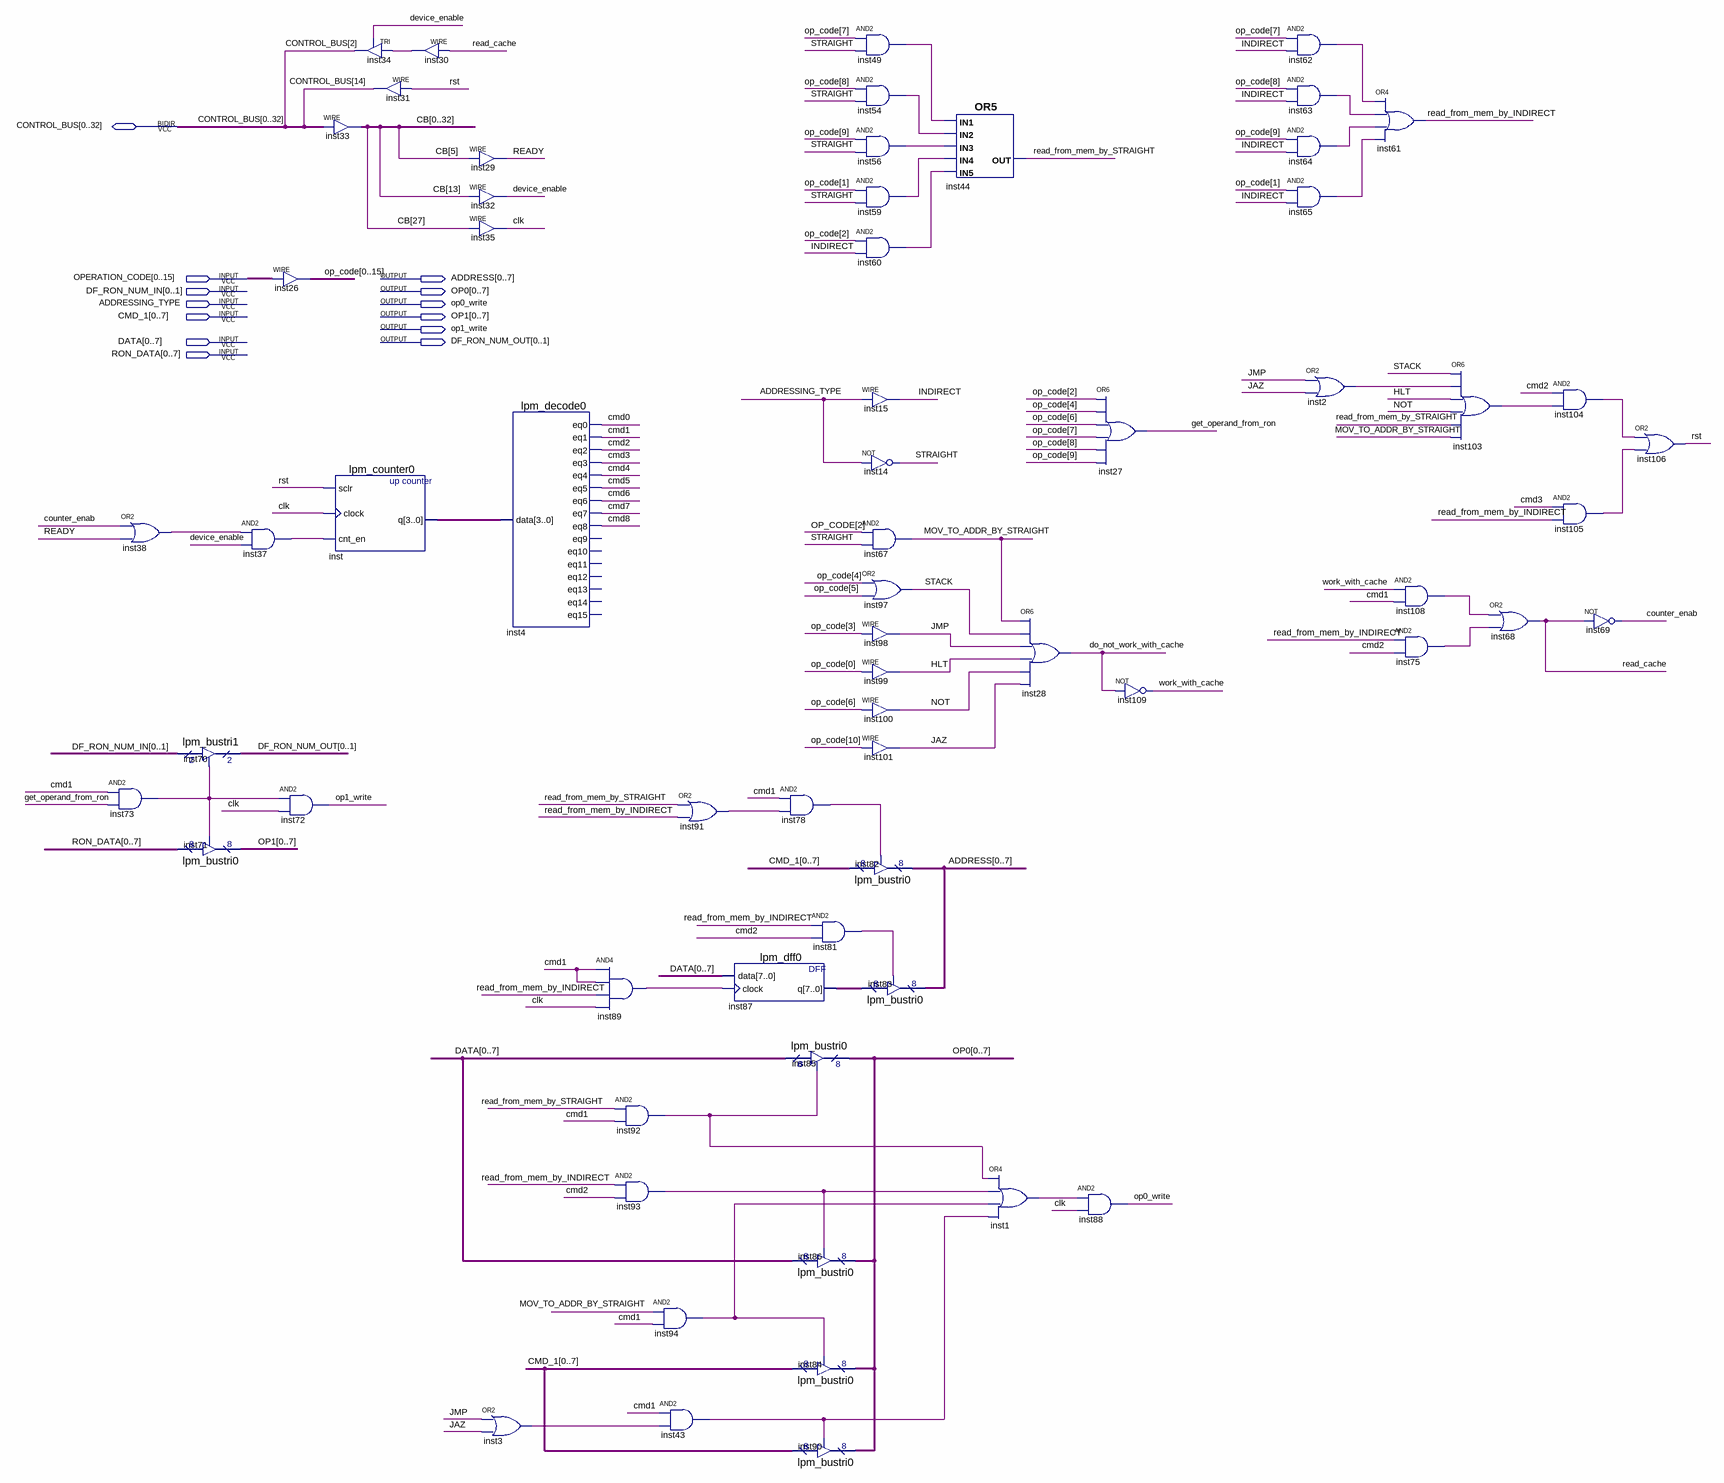
[diagram p0: schematic sheet]
// Quartus schematic DF.bdf as structural Verilog: 65 symbols, 13 pins
module DF (
  input  [0:15] OPERATION_CODE,
  input  [0:1] DF_RON_NUM_IN,
  input  ADDRESSING_TYPE,
  input  [0:7] CMD_1,
  input  [0:7] DATA,
  input  [0:7] RON_DATA,
  inout  [0:32] CONTROL_BUS,
  output [0:7] ADDRESS,
  output [0:7] OP0,
  output op0_write,
  output [0:7] OP1,
  output op1_write,
  output [0:1] DF_RON_NUM_OUT
);

  wire clk, cmd0, cmd1, cmd2, cmd3, cmd4, cmd5, cmd6, cmd7, cmd8, counter_enab, device_enable,
       do_not_work_with_cache, get_operand_from_ron, HLT, INDIRECT, inst1_out, inst2_out, inst3_out,
       inst30_out, inst37_out, inst38_out, inst43_out, inst49_out, inst54_out, inst56_out, inst59_out,
       inst60_out, inst62_out, inst63_out, inst64_out, inst65_out, inst73_out, inst75_out, inst78_out,
       inst81_out, inst89_out, inst91_out, inst92_out, inst93_out, inst94_out, inst103_out, inst104_out,
       inst105_out, inst108_out, JAZ, JMP, MOV_TO_ADDR_BY_STRAIGHT, NOT, read_cache,
       read_from_mem_by_INDIRECT, read_from_mem_by_STRAIGHT, READY, rst, STACK, STRAIGHT, work_with_cache;
  wire [3:0] inst_q;
  wire [7:0] inst87_q;
  wire [15:0] op_code;
  wire [32:0] CB;

  or inst38 (inst38_out, counter_enab, READY);
  and inst73 (inst73_out, cmd1, get_operand_from_ron);
  lpm_bustri1 inst70 (.enabledt(inst73_out), .data(DF_RON_NUM_IN), .tridata(DF_RON_NUM_OUT));
  lpm_bustri0 inst71 (.enabledt(inst73_out), .data(RON_DATA), .tridata(OP1));
  assign {op_code[0], op_code[1], op_code[2], op_code[3], op_code[4], op_code[5], op_code[6], op_code[7], op_code[8], op_code[9], op_code[10], op_code[11], op_code[12], op_code[13], op_code[14], op_code[15]} = OPERATION_CODE;  // WIRE inst26
  and inst37 (inst37_out, inst38_out, device_enable);
  and inst72 (op1_write, inst73_out, clk);
  assign {CB[0], CB[1], CB[2], CB[3], CB[4], CB[5], CB[6], CB[7], CB[8], CB[9], CB[10], CB[11], CB[12], CB[13], CB[14], CB[15], CB[16], CB[17], CB[18], CB[19], CB[20], CB[21], CB[22], CB[23], CB[24], CB[25], CB[26], CB[27], CB[28], CB[29], CB[30], CB[31], CB[32]} = CONTROL_BUS;  // WIRE inst33
  lpm_counter0 inst (.sclr(rst), .clock(clk), .cnt_en(inst37_out), .q(inst_q));
  TRI inst34 (.IN(inst30_out), .OE(device_enable), .OUT(CONTROL_BUS[2]));
  assign CONTROL_BUS[14] = rst;  // WIRE inst31
  assign inst30_out = read_cache;  // WIRE inst30
  assign READY = CB[5];  // WIRE inst29
  assign device_enable = CB[13];  // WIRE inst32
  assign clk = CB[27];  // WIRE inst35
  or inst3 (inst3_out, JMP, JAZ);
  lpm_decode0 inst4 (
    .data(inst_q), .eq0(cmd0), .eq1(cmd1), .eq2(cmd2), .eq3(cmd3), .eq4(cmd4), .eq5(cmd5), .eq6(cmd6),
    .eq7(cmd7), .eq8(cmd8));  // open: eq9, eq10, eq11, eq12, eq13, eq14, eq15
  and inst89 (inst89_out, cmd1, cmd1, read_from_mem_by_INDIRECT, clk);
  and inst92 (inst92_out, read_from_mem_by_STRAIGHT, cmd1);
  and inst93 (inst93_out, read_from_mem_by_INDIRECT, cmd2);
  or inst91 (inst91_out, read_from_mem_by_STRAIGHT, read_from_mem_by_INDIRECT);
  and inst94 (inst94_out, MOV_TO_ADDR_BY_STRAIGHT, cmd1);
  and inst43 (inst43_out, cmd1, inst3_out);
  lpm_dff0 inst87 (.data(DATA), .clock(inst89_out), .q(inst87_q));
  and inst78 (inst78_out, cmd1, inst91_out);
  lpm_bustri0 inst85 (.enabledt(inst92_out), .data(DATA), .tridata(OP0));
  and inst81 (inst81_out, read_from_mem_by_INDIRECT, cmd2);
  lpm_bustri0 inst86 (.enabledt(inst93_out), .data(DATA), .tridata(OP0));
  lpm_bustri0 inst84 (.enabledt(inst94_out), .data(CMD_1), .tridata(OP0));
  lpm_bustri0 inst90 (.enabledt(inst43_out), .data(CMD_1), .tridata(OP0));
  and inst49 (inst49_out, op_code[7], STRAIGHT);
  and inst54 (inst54_out, op_code[8], STRAIGHT);
  and inst56 (inst56_out, op_code[9], STRAIGHT);
  and inst59 (inst59_out, op_code[1], STRAIGHT);
  and inst60 (inst60_out, op_code[2], INDIRECT);
  assign INDIRECT = ADDRESSING_TYPE;  // WIRE inst15
  not inst14 (STRAIGHT, ADDRESSING_TYPE);
  and inst67 (MOV_TO_ADDR_BY_STRAIGHT, op_code[2], STRAIGHT);
  or inst97 (STACK, op_code[4], op_code[5]);
  assign JMP = op_code[3];  // WIRE inst98
  assign HLT = op_code[0];  // WIRE inst99
  assign NOT = op_code[6];  // WIRE inst100
  assign JAZ = op_code[10];  // WIRE inst101
  lpm_bustri0 inst82 (.enabledt(inst78_out), .data(CMD_1), .tridata(ADDRESS));
  lpm_bustri0 inst83 (.enabledt(inst81_out), .data(inst87_q), .tridata(ADDRESS));
  or inst44 (read_from_mem_by_STRAIGHT, inst49_out, inst54_out, inst56_out, inst59_out, inst60_out);
  or inst1 (inst1_out, inst92_out, inst93_out, inst94_out, inst43_out);
  or inst28 (do_not_work_with_cache, MOV_TO_ADDR_BY_STRAIGHT, STACK, JMP, HLT, NOT, JAZ);
  and inst88 (op0_write, inst1_out, clk);
  or inst27 (get_operand_from_ron, op_code[2], op_code[4], op_code[6], op_code[7], op_code[8], op_code[9]);
  not inst109 (work_with_cache, do_not_work_with_cache);
  and inst62 (inst62_out, op_code[7], INDIRECT);
  and inst63 (inst63_out, op_code[8], INDIRECT);
  and inst64 (inst64_out, op_code[9], INDIRECT);
  and inst65 (inst65_out, op_code[1], INDIRECT);
  or inst2 (inst2_out, JMP, JAZ);
  or inst61 (read_from_mem_by_INDIRECT, inst62_out, inst63_out, inst64_out, inst65_out);
  and inst108 (inst108_out, work_with_cache, cmd1);
  and inst75 (inst75_out, read_from_mem_by_INDIRECT, cmd2);
  or inst103 (inst103_out, STACK, inst2_out, HLT, NOT, read_from_mem_by_STRAIGHT, MOV_TO_ADDR_BY_STRAIGHT);
  or inst68 (read_cache, inst108_out, inst75_out);
  and inst104 (inst104_out, cmd2, inst103_out);
  and inst105 (inst105_out, cmd3, read_from_mem_by_INDIRECT);
  not inst69 (counter_enab, read_cache);
  or inst106 (rst, inst104_out, inst105_out);
endmodule
